# Altium schematic sheet esp32.SchDoc
size A
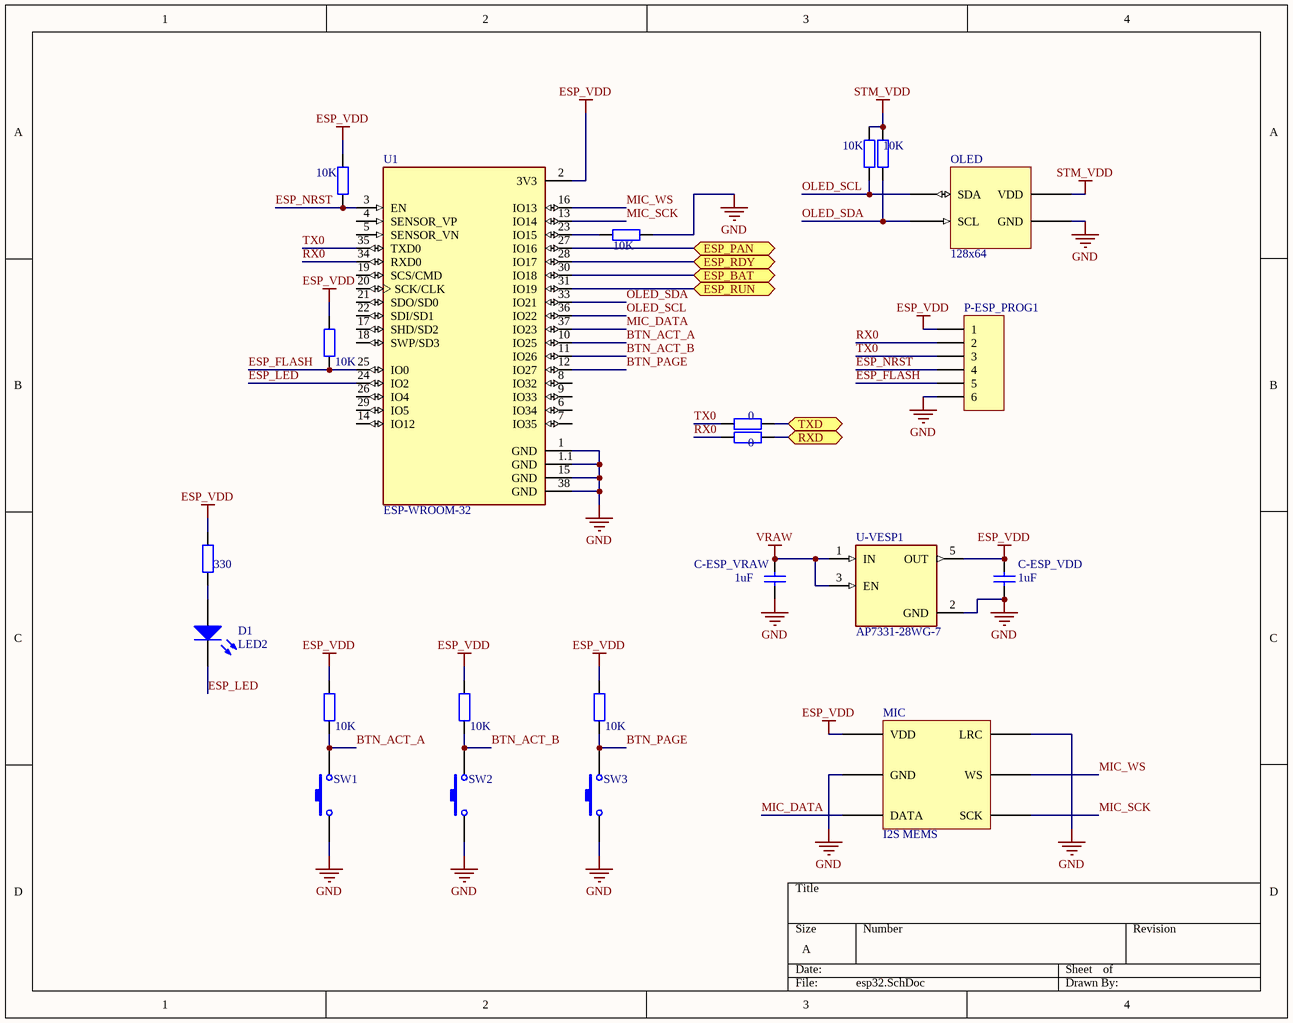
[diagram p0: esp32.SchDoc]

## Parts
C-ESP_VDD  value 1uF  [RAD-0.3]  (hidden comment: Cap)
C-ESP_VRAW  value 1uF  [RAD-0.3]  (hidden comment: Cap)
D1  LED2  [3.2X1.6X1.1]
MIC  I2S MEMS
OLED  128x64
P-ESP_PROG1  Header 6  [HDR1X6]  (value not drawn)
R-BUTTON1  value 10K  [AXIAL-0.4]  (hidden comment: Res2)
R-BUTTON2  value 10K  [AXIAL-0.4]  (hidden comment: Res2)
R-BUTTON3  value 10K  [AXIAL-0.4]  (hidden comment: Res2)
R-ESP1  value 10K  [AXIAL-0.4]  (hidden comment: Res2)
R-ESP2  value 10K  [AXIAL-0.4]  (hidden comment: Res2)
R-ESP-LOG1  value 10K  [AXIAL-0.4]  (hidden comment: Res2)
R-LED1  value 330  [AXIAL-0.4]  (hidden comment: Res2)
R-OLED1  value 10K  [AXIAL-0.4]  (hidden comment: Res2)
R-OLED2  value 10K  [AXIAL-0.4]  (hidden comment: Res2)
R-UART1  value 0  [AXIAL-0.4]  (hidden comment: Res2)
R-UART2  value 0  [AXIAL-0.4]  (hidden comment: Res2)
SW1  SW-PB  [SPST-2]  (value not drawn)
SW2  SW-PB  [SPST-2]  (value not drawn)
SW3  SW-PB  [SPST-2]  (value not drawn)
U1  ESP-WROOM-32  [MODULE_ESP-WROOM-32]
U-VESP1  AP7331-28WG-7  [SOT95P285X145-5N]

## Ports
ESP_BAT, ESP_PAN, ESP_RDY, ESP_RUN, RXD, TXD

## Nets
ESP_VDD: C-ESP_VDD.2 MIC.VDD P-ESP_PROG1.1 R-BUTTON1.2 R-BUTTON2.2 R-BUTTON3.2 R-ESP1.2 R-ESP2.2 R-LED1.2 U1.2(3V3) U-VESP1.5(OUT)
GND: C-ESP_VDD.1 C-ESP_VRAW.1 MIC.GND MIC.LRC OLED.GND P-ESP_PROG1.6 R-ESP-LOG1.1 SW1.1 SW2.1 SW3.1 U1.1(GND) U1.1.1(GND) U1.15(GND) U1.38(GND) U-VESP1.2(GND)
STM_VDD: OLED.VDD R-OLED1.2 R-OLED2.2
VRAW: C-ESP_VRAW.2 U-VESP1.1(IN) U-VESP1.3(EN)
BTN_ACT_A: R-BUTTON1.1 SW1.2 U1.10(IO25)
BTN_ACT_B: R-BUTTON2.1 SW2.2 U1.11(IO26)
BTN_PAGE: R-BUTTON3.1 SW3.2 U1.12(IO27)
ESP_BAT: U1.30(IO18) ; port ESP_BAT
ESP_FLASH: P-ESP_PROG1.5 R-ESP2.1 U1.25(IO0)
ESP_LED: D1.2(K) U1.24(IO2)
ESP_NRST: P-ESP_PROG1.4 R-ESP1.1 U1.3(EN)
ESP_PAN: U1.27(IO16) ; port ESP_PAN
ESP_RDY: U1.28(IO17) ; port ESP_RDY
ESP_RUN: U1.31(IO19) ; port ESP_RUN
MIC_DATA: MIC.DATA U1.37(IO23)
MIC_SCK: MIC.SCK U1.13(IO14)
MIC_WS: MIC.WS U1.16(IO13)
OLED_SCL: OLED.SDA R-OLED2.1 U1.36(IO22)
OLED_SDA: OLED.SCL R-OLED1.1 U1.33(IO21)
RX0: P-ESP_PROG1.2 R-UART2.1 U1.34(RXD0)
RXD: R-UART2.2 ; port RXD
TX0: P-ESP_PROG1.3 R-UART1.1 U1.35(TXD0)
TXD: R-UART1.2 ; port TXD
NetD1_1: D1.1(A) R-LED1.1
NetR-ESP-LOG1_2: R-ESP-LOG1.2 U1.23(IO15)

Not connected (* = marked no-connect by the designer): U1 4(SENSOR_VP) 5(SENSOR_VN) 6(IO34) 7(IO35) 8(IO32) 9(IO33) 14(IO12) 17(SHD/SD2) 18(SWP/SD3) 19(SCS/CMD) 20(SCK/CLK) 21(SDO/SD0) 22(SDI/SD1) 26(IO4) 29(IO5)

## Library data of the parts
C-ESP_VDD C-ESP_VRAW = Cap: Capacitor; Published: 8-Jun-2000; LatestRevisionDate: 17-Jul-2002; LatestRevisionNote: Re-released for DXP Platform.; PackageReference: RAD-0.3; Publisher: Altium Limited; PackageDescription: Radial Cap, Thru-Hole; 2 Leads; 0.3 in Pin Spacing
D1 = LED2: Typical RED, GREEN, YELLOW, AMBER GaAs LED; Published: 8-Jun-2000; LatestRevisionDate: 17-Jul-2002; LatestRevisionNote: Re-released for DXP Platform.; PackageVersion: Feb-2002; PackageReference: 3.2X1.6X1.1; Publisher: Altium Limited; PackageDescription: SM LED; 2 Flat Leads
MIC = INMP441
OLED = SH1106
P-ESP_PROG1 = Header 6: Header, 6-Pin; LatestRevisionDate: 17-Jul-2002; LatestRevisionNote: Re-released for DXP Platform.; Publisher: Altium Limited
R-BUTTON1-R-BUTTON3 R-ESP1 R-ESP2 R-ESP-LOG1 R-LED1 R-OLED1 R-OLED2 R-UART1 R-UART2 = Res2: Resistor; Published: 8-Jun-2000; LatestRevisionDate: 17-Jul-2002; LatestRevisionNote: Re-released for DXP Platform.; PackageReference: AXIAL-0.4; Publisher: Altium Limited; PackageDescription: Axial Device, Thru-Hole; 2 Leads; 0.4 in Pin Spacing
SW1-SW3 = SW-PB: Switch; Published: 24-Mar-1999; LatestRevisionDate: 17-Jul-2002; LatestRevisionNote: Re-released for DXP Platform.; PackageReference: SPST-2; Publisher: Altium Limited; PackageDescription: Switch; 2 Leads
U1 = ESP-WROOM-32: WiFi 802.11b/g/n/d/e/i Transceiver Module 2.4GHz Surface Mount; MF: Olimex LTD; Value: *; SnapEDA_Link: https://www.snapeda.com/parts/ESP-WROOM-32/Olimex%20LTD/view-part/2311927/?ref=snap; MP: ESP-WROOM-32; Availability: Unavailable; Price: None; Package: Module Olimex LTD
U-VESP1 = AP7331-28WG-7: Linear Voltage Regulator IC 1 Output 300mA SOT-25; MF: Diodes Inc.; Price: None; Package: SOT-753 Diodes Inc.; MP: AP7331-28WG-7; Value: *; Availability: Unavailable; SnapEDA_Link: https://www.snapeda.com/parts/AP7331-28WG-7/Diodes%20Inc./view-part/622293/?ref=snap